# Altium schematic sheet Power_HK.SchDoc: Hrafn
size Tabloid; DrawnBy: Nicholas Belsten; Organization: MIT; Address1: Route 40; Address2: Westford MA 01886; Address3: USA; DocumentNumber: 5; SheetNumber: 6; SheetTotal: 10; DCN: Aika; ProgramName: AERO-VISTA; Section: Power + Housekeeping
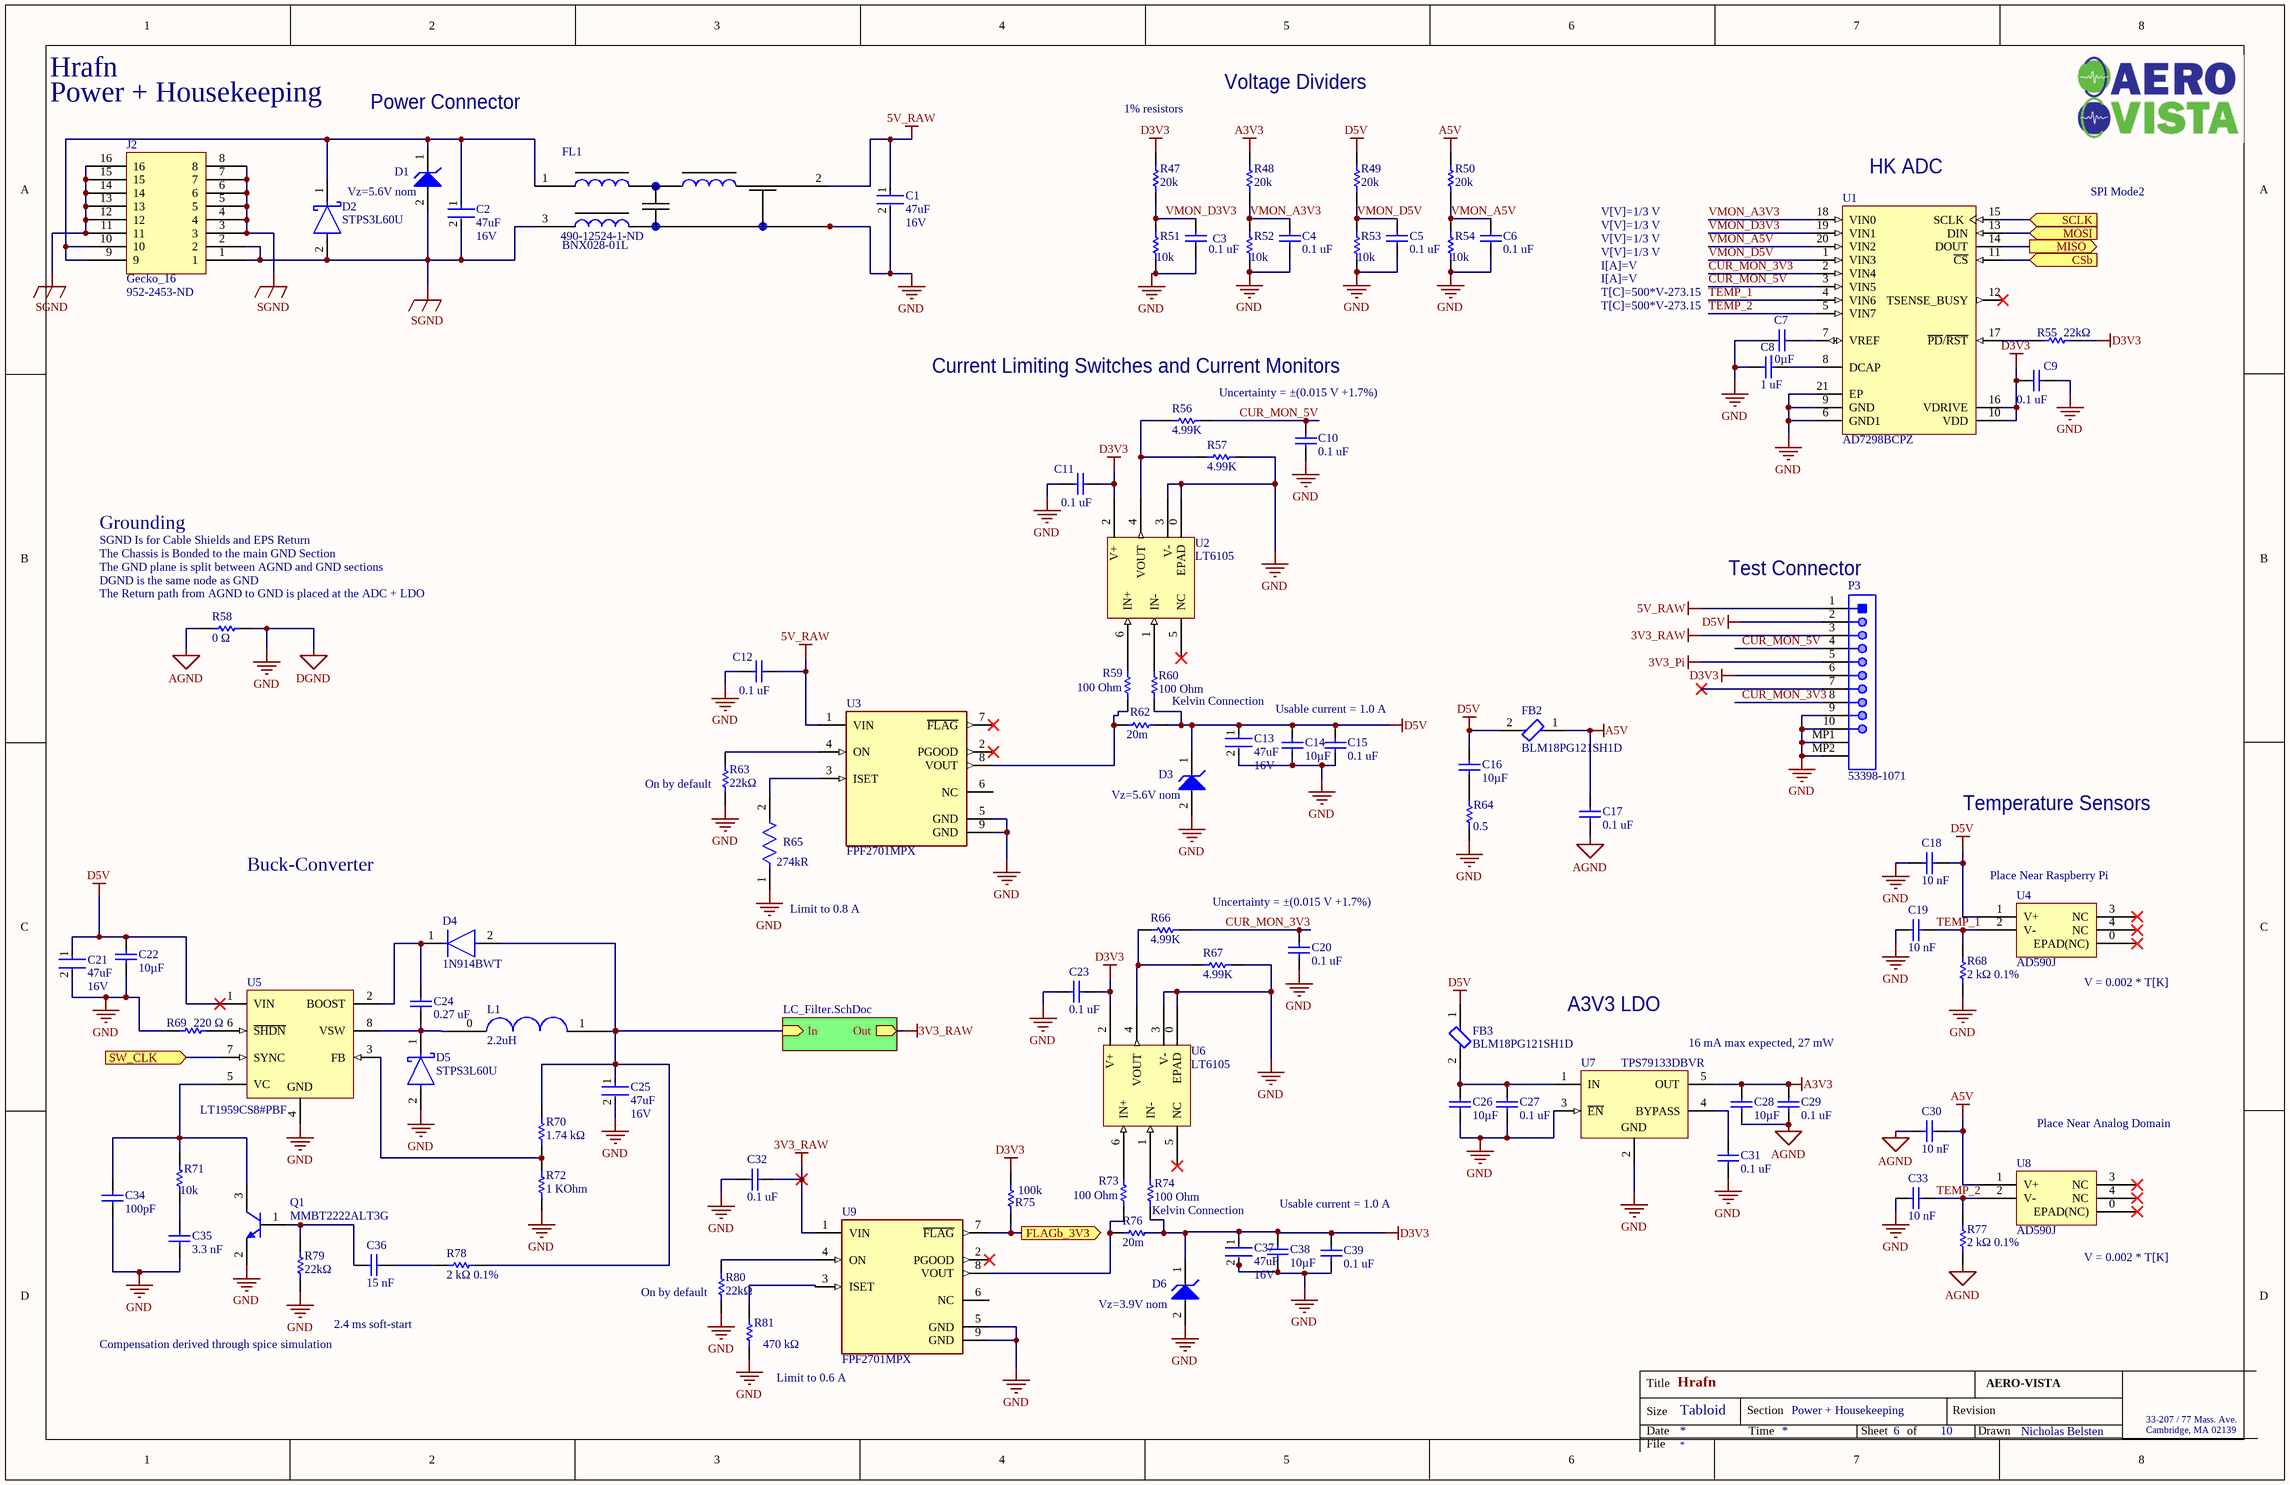
[diagram p0: Power_HK.SchDoc]

## Parts
C1  Capacitance: 47uF  Voltage Rating: 16V  [FP-GRT32E-0_3-IPC_C]  (hidden comment: GRT32EC81C476ME13L)
C2  Capacitance: 47uF  Voltage Rating: 16V  [FP-GRT32E-0_3-IPC_C]  (hidden comment: GRT32EC81C476ME13L)
C3  0.1 uF  [CAPC0402(1005)60_L]
C4  0.1 uF  [CAPC0402(1005)60_L]
C5  0.1 uF  [CAPC0402(1005)60_L]
C6  0.1 uF  [CAPC0402(1005)60_L]
C7  Capacitance: 10µF  [CAPC1608X100X35LL20T25]  (hidden comment: EMK107BBJ106MA-T)
C8  1 uF  [CAPC1005X60X30NL05T10]
C9  0.1 uF  [CAPC0402(1005)60_L]
C10  0.1 uF  [CAPC0402(1005)60_L]
C11  0.1 uF  [CAPC0402(1005)60_L]
C12  0.1 uF  [CAPC0402(1005)60_L]
C13  Capacitance: 47uF  Voltage Rating: 16V  [FP-GRT32E-0_3-IPC_C]  (hidden comment: GRT32EC81C476ME13L)
C14  Capacitance: 10µF  [CAPC1608X100X35LL20T25]  (hidden comment: EMK107BBJ106MA-T)
C15  0.1 uF  [CAPC0402(1005)60_L]
C16  Capacitance: 10µF  [CAPC1608X100X35LL20T25]  (hidden comment: EMK107BBJ106MA-T)
C17  0.1 uF  [CAPC0402(1005)60_L]
C18  10 nF  [CAPC1005X56X25NL10T15]
C19  10 nF  [CAPC1005X56X25NL10T15]
C20  0.1 uF  [CAPC0402(1005)60_L]
C21  Capacitance: 47uF  Voltage Rating: 16V  [FP-GRT32E-0_3-IPC_C]  (hidden comment: GRT32EC81C476ME13L)
C22  Capacitance: 10µF  [CAPC1608X100X35LL20T25]  (hidden comment: EMK107BBJ106MA-T)
C23  0.1 uF  [CAPC0402(1005)60_L]
C24  0.27 uF  [CAPC1005X55X25LL05T10]
C25  Capacitance: 47uF  Voltage Rating: 16V  [FP-GRT32E-0_3-IPC_C]  (hidden comment: GRT32EC81C476ME13L)
C26  Capacitance: 10µF  [CAPC1608X100X35LL20T25]  (hidden comment: EMK107BBJ106MA-T)
C27  0.1 uF  [CAPC0402(1005)60_L]
C28  Capacitance: 10µF  [CAPC1608X100X35LL20T25]  (hidden comment: EMK107BBJ106MA-T)
C29  0.1 uF  [CAPC0402(1005)60_L]
C30  10 nF  [CAPC1005X56X25NL10T15]
C31  0.1 uF  [CAPC0402(1005)60_L]
C32  0.1 uF  [CAPC0402(1005)60_L]
C33  10 nF  [CAPC1005X56X25NL10T15]
C34  100pF  [CAPC1005X55X25ML05T10]
C35  3.3 nF  [CAPC1005X56X25ML10T15]
C36  15 nF  [CAPC1005X55X25NL05T10]
C37  Capacitance: 47uF  Voltage Rating: 16V  [FP-GRT32E-0_3-IPC_C]  (hidden comment: GRT32EC81C476ME13L)
C38  Capacitance: 10µF  [CAPC1608X100X35LL20T25]  (hidden comment: EMK107BBJ106MA-T)
C39  0.1 uF  [CAPC0402(1005)60_L]
D1  Vz=5.6V nom  [ONSC-SMA-2-403D-02_F_V]
D2  STPS3L60U  [FP-SMB-MFG]
D3  Vz=5.6V nom  [ONSC-SMA-2-403D-02_F_V]
D4  1N914BWT  [FP-502-01-MFG]
D5  STPS3L60U  [FP-SMB-MFG]
D6  Vz=3.9V nom  [ONSC-SMA-2-403D-02_F_V]
FB2  BLM18PG121SH1D  [FP-BLM18-0_15-t0_8-IPC_C]
FB3  BLM18PG121SH1D  [FP-BLM18-0_15-t0_8-IPC_C]
FL1  BNX028-01L  Supplier Part Number 1: 490-12524-1-ND  [FIL_BNX028-01L - small]
J2  Gecko_16  Supplier Part Number 1: 952-2453-ND  [GECK16]
L1  Inductance: 2.2uH  [78438357022]  (hidden comment: L)
P3  53398-1071  [MOLX-53398-1071_V]
Q1  MMBT2222ALT3G  [ONSC-SOT-23-3-318-08_V]
R47  Resistance: 20k  [RESC1005X40X25LL05T10]  (hidden comment: RC0402FR-0720KL)
R48  Resistance: 20k  [RESC1005X40X25LL05T10]  (hidden comment: RC0402FR-0720KL)
R49  Resistance: 20k  [RESC1005X40X25LL05T10]  (hidden comment: RC0402FR-0720KL)
R50  Resistance: 20k  [RESC1005X40X25LL05T10]  (hidden comment: RC0402FR-0720KL)
R51  Resistance: 10k  [RESC1005X40X25LL05T10]  (hidden comment: CRCW040210K0FKEDHP)
R52  Resistance: 10k  [RESC1005X40X25LL05T10]  (hidden comment: CRCW040210K0FKEDHP)
R53  Resistance: 10k  [RESC1005X40X25LL05T10]  (hidden comment: CRCW040210K0FKEDHP)
R54  Resistance: 10k  [RESC1005X40X25LL05T10]  (hidden comment: CRCW040210K0FKEDHP)
R55  22kΩ  [RESC1005X40X25LL05T05]
R56  4.99K  [RESC1005X40X25LL05T05]
R57  4.99K  [RESC1005X40X25LL05T05]
R58  =Resistance: 0 Ω  [RESC1608X55X25LL10T15]  (hidden comment: AC0603JR-070RL)
R59  Resistance: 100 Ohm  [RESC1005X40X25LL05T05]  (hidden comment: ERJ-2RKF1000X)
R60  Resistance: 100 Ohm  [RESC1005X40X25LL05T05]  (hidden comment: ERJ-2RKF1000X)
R62  20m  [RESC1608X55X25LL10T15]
R63  22kΩ  [RESC1005X40X25LL05T05]
R64  0.5  [RESC1005X40X25LL10T10]
R65  Resistance: 274kR  [FP-CRCW0402-e3-IPC_A]  (hidden comment: CRCW0402274KFKED)
R66  4.99K  [RESC1005X40X25LL05T05]
R67  4.99K  [RESC1005X40X25LL05T05]
R68  2 kΩ 0.1%  [RESC1005X40X25LL10T10]
R69  220 Ω  [RESC1005X40X25LL05T05]
R70  1.74 kΩ  [RESC1005X40X25NL05T10]
R71  Resistance: 10k  [RESC1005X40X25LL05T10]  (hidden comment: CRCW040210K0FKEDHP)
R72  1 KOhm  [RESC1005X40X25NL05T05]
R73  Resistance: 100 Ohm  [RESC1005X40X25LL05T05]  (hidden comment: ERJ-2RKF1000X)
R74  Resistance: 100 Ohm  [RESC1005X40X25LL05T05]  (hidden comment: ERJ-2RKF1000X)
R75  Resistance: 100k  [RESC1005X40X25LL05T05]  (hidden comment: CRCW0402100KJNED)
R76  20m  [RESC1608X55X25LL10T15]
R77  2 kΩ 0.1%  [RESC1005X40X25LL10T10]
R78  2 kΩ 0.1%  [RESC1005X40X25LL10T10]
R79  22kΩ  [RESC1005X40X25LL05T05]
R80  22kΩ  [RESC1005X40X25LL05T05]
R81  Resistance: 470 kΩ  [RESC1005X40X25LL05T05]  (hidden comment: ERJ2RKF4703X)
U1  AD7298BCPZ  [CP-20-8_M]
U2  LT6105  [LT6105]
U3  FPF2701MPX  [FP-511DD-MFG]
U4  AD590J  [DFN260P300X75-4N]
U5  LT1959CS8#PBF  [LT-S8-8_L]
U6  LT6105  [LT6105]
U7  TPS79133DBVR  [DBV0005A_N]
U8  AD590J  [DFN260P300X75-4N]
U9  FPF2701MPX  [FP-511DD-MFG]

## Sub-sheets
LCF = LC_Filter.SchDoc: In (in), Out (out)

## Ports
CSb (in), FLAGb_3V3 (out), MISO (out), MOSI (in), SCLK (in), SW_CLK (in)

## Nets
3V3_Pi: P3.5
3V3_RAW: C32.1 P3.3 U9.1(VIN) ; sheet LCF/Out
5V_RAW: C1.1 C12.2 FL1.2(CB) P3.1 U3.1(VIN)
A3V3: C28.2 C29.2 R48.2 U7.5(OUT)
A5V: C17.2 C30.2 FB2.1 R50.2 U8.1(V+)
AGND: C17.1 C28.1 C29.1 C30.1 R58.1 R77.1
D3V3: C9.1 C11.2 C23.1 C37.1 C38.2 C39.2 D6.1(K) P3.6 R47.2 R55.2 R74.1 R75.2 R76.2 U1.10(VDD) U1.16(VDRIVE) U2.2(V+) U6.2(V+)
D5V: C13.1 C14.2 C15.2 C16.2 C18.2 C21.1 C22.2 D3.1(K) FB2.2 FB3.1 P3.2 R49.2 R60.1 R62.2 U4.1(V+) U5.1(VIN)
DGND: C1.2 C3.1 C4.1 C5.1 C6.1 C7.1 C8.2 C9.2 C10.1 C11.1 C12.1 C13.2 C14.1 C15.1 C18.1 C19.1 C20.1 C21.2 C22.1 C23.2 C25.2 C26.1 C27.1 C31.1 C32.2 C33.1 C34.1 C35.1 C37.2 C38.1 C39.1 D3.2(A) D5.2(A) D6.2(A) FL1.4(CG) FL1.5(CG) FL1.6(CG) P3.9 P3.10 P3.MP1 P3.MP2 Q1.2(E) R51.1 R52.1 R53.1 R54.1 R57.2 R58.2 R63.1 R64.1 R65.1 R67.2 R68.1 R69.1 R72.1 R79.1 R80.1 R81.1 U1.6(GND1) U1.9(GND) U1.21(EP) U2.0(EPAD) U2.3(V-) U3.5(GND) U3.9(GND) U5.4(GND) U6.0(EPAD) U6.3(V-) U7.2(GND) U7.3(~{EN}) U9.5(GND) U9.9(GND)  [also labelled GND]
SGND: C2.2 D1.2(A) D2.2(A) FL1.3(PSG) J2.1 J2.2 J2.3 J2.4 J2.5 J2.6 J2.7 J2.8 J2.11 J2.12 J2.13 J2.14 J2.15 J2.16
CSb: U1.11(~{CS}) ; port CSb
CUR_MON_3V3: C20.2 P3.8 R66.2 U1.2(VIN4)
CUR_MON_5V: C10.2 P3.4 R56.2 U1.3(VIN5)
FLAGb_3V3: R75.1 U9.7(~{FLAG}) ; port FLAGb_3V3
MISO: U1.14(DOUT) ; port MISO
MOSI: U1.13(DIN) ; port MOSI
SCLK: U1.15(SCLK) ; port SCLK
SW_CLK: U5.7(SYNC) ; port SW_CLK
TEMP_1: C19.2 R68.2 U1.4(VIN6) U4.2(V-)
TEMP_2: C33.2 R77.2 U1.5(VIN7) U8.2(V-)
VMON_A3V3: C4.2 R48.1 R52.2 U1.18(VIN0)
VMON_A5V: C6.2 R50.1 R54.2 U1.20(VIN2)
VMON_D3V3: C3.2 R47.1 R51.2 U1.19(VIN1)
VMON_D5V: C5.2 R49.1 R53.2 U1.1(VIN3)
NetC2_1: C2.1 D1.1(K) D2.1(K) FL1.1(B) J2.9 J2.10
NetC7_2: C7.2 U1.7(VREF)
NetC8_1: C8.1 U1.8(DCAP)
NetC16_1: C16.1 R64.2
NetC24_1: C24.1 D5.1(K) L1.0 U5.8(VSW)
NetC24_2: C24.2 D4.1(C) U5.2(BOOST)
NetC25_1: C25.1 D4.2(A) L1.1 R70.2 R78.1 ; sheet LCF/In
NetC26_2: C26.2 C27.2 FB3.2 U7.1(IN)
NetC31_2: C31.2 U7.4(BYPASS)
NetC34_2: C34.2 Q1.3(C) R71.2 U5.5(VC)
NetC35_2: C35.2 R71.1
NetC36_1: C36.1 Q1.1(B) R79.2
NetC36_2: C36.2 R78.2
NetR55_1: R55.1 U1.17(~{PD}/~{RST})
NetR56_1: R56.1 R57.1 U2.4(VOUT)
NetR59_1: R59.1 R62.1 U3.8(VOUT)
NetR59_2: R59.2 U2.6(IN+)
NetR60_2: R60.2 U2.1(IN-)
NetR63_2: R63.2 U3.4(ON)
NetR65_2: R65.2 U3.3(ISET)
NetR66_1: R66.1 R67.1 U6.4(VOUT)
NetR69_2: R69.2 U5.6(~{SHDN})
NetR70_1: R70.1 R72.2 U5.3(FB)
NetR73_1: R73.1 R76.1 U9.8(VOUT)
NetR73_2: R73.2 U6.6(IN+)
NetR74_2: R74.2 U6.1(IN-)
NetR80_2: R80.2 U9.4(ON)
NetR81_2: R81.2 U9.3(ISET)

Not connected (* = marked no-connect by the designer): P3 7*; U1 12(TSENSE_BUSY)*; U2 5(NC)*; U3 2(PGOOD)* 6(NC) 7(~{FLAG})*; U4 0(EPAD(NC))* 3(NC)* 4(NC)*; U6 5(NC)*; U8 0(EPAD(NC))* 3(NC)* 4(NC)*; U9 2(PGOOD)* 6(NC)

## Notes on the sheet
- Voltage Dividers
- Power Connector
- 1% resistors
- V[V]=1/3 V
- (near U1) HK ADC
- SPI Mode2
- I[A]=V
- T[C]=500*V-273.15
- Current Limiting Switches and Current Monitors
- Uncertainty = ±(0.015 V +1.7%)
- Grounding
- SGND Is for Cable Shields and EPS Return
- The Chassis is Bonded to the main GND Section
- The GND plane is split between AGND and GND sections
- (near R58) The Return path from AGND to GND is placed at the ADC + LDO
- (near R58) DGND is the same node as GND
- (near P3) Test Connector
- Kelvin Connection
- Usable current = 1.0 A
- (near R63) On by default
- Temperature Sensors
- Buck-Converter
- Place Near Raspberry Pi
- Limit to 0.8 A
- A3V3 LDO
- (near U4) V = 0.002 * T[K]
- 16 mA max expected, 27 mW
- Place Near Analog Domain
- (near R74) Kelvin Connection
- (near R80) On by default
- (near U8) V = 0.002 * T[K]
- Compensation derived through spice simulation
- 2.4 ms soft-start
- Limit to 0.6 A
- Title
- Size
- Date
- Tabloid
- Section
- Time
- Sheet
- of
- Revision
- Drawn
- 33-207 / 77 Mass. Ave.
- Cambridge, MA 02139
- File

## Library data of the parts
C1 C2 C13 C21 C25 C37 = CMP-06035-034903-1: Multi-Layer Ceramic Capacitor 47uF 16V X6S ±20% 1210 Emboss T/R; Ratings: AEC-Q200; Thickness: 0.106inch; Max Operating Temperature: 105°C; Width: 0.098inch; Case/Package: 1210; Length: 0.126inch; Mount: Surface Mount; Min Operating Temperature: -55°C; Tolerance: 20%; Case Code (Imperial): 1210; Case Code (Metric): 3225; Packaging: Tape and Reel
C3-C6 C9-C12 C15 C17 C20 C23 C27 C29 C31 C32 C39 = CMP-1034-02068-1: CAP 100nF 16V ±5% 0402 (1005 Metric) Thickness 0.6mm SMD; Tolerance: Â±5%; Case-EIA: 0402; Case-Metric: 1005; Technology: SMT; Value: 100nF; Max Thickness: 0.6 mm; Rated Voltage: 16 V
C7 C14 C16 C22 C26 C28 C38 = CMP-2000-06226-1: Chip Capacitor, 10 uF, +/- 20%, 16 V, -55 to 85 degC, 0603 (1608 Metric), RoHS, Tape and Reel; Manufacturer: Taiyo Yuden; Voltage - Rated: 16V; Temperature Coefficient: X5R; Other Names: 587-3238-6; Online Catalog: MSeries; Features: -; Thickness (Max): 0.031"(0.80mm); Package / Case: 0603(1608Metric); Datasheet URL: http://www.yuden.co.jp/ut/product/category/capacitor/EMK107BBJ106MA-T.pdf; Category: Capacitors; Lead Style: -; Family: CeramicCapacitors; Package Description: 2-Pin Surface Mount Device, Body 1.70 x 0.90 mm; Tolerance: ±20%; Manufacturer URL: http://www.t-yuden.com/; Operating Temperature: -55°C~85°C; Lead Spacing: -; Height - Seated (Max): -; Series: M; Applications: GeneralPurpose; Size / Dimension: 0.063"Lx0.031"W(1.60mmx0.80mm); Standard Package: 1; Packaging: Digi-Reel®; Mounting Technology: SurfaceMount; Package Reference: 0603; Ratings: -; Datasheet Version: 10/2016; Mounting Type: SurfaceMount,MLCC
C8 = CMP-2008-02056-1: Part Number: C0402C105M8PACTU; Manufacturer: Kemet; Capacitance: 1 uF
C18 C19 C30 C33 = CMP-2008-02912-1: Part Number: 0402ZC103KAT2A; Manufacturer: AVX Interconnect / Elco; Capacitance: 10 nF
C24 = CMP-2008-03996-1: Part Number: GRM155R61A274KE15D; Manufacturer: Murata; Capacitance: 0.27 uF
C34 = CMP-2008-03915-1: Manufacturer: Murata; Part Number: GRM1555C1H101JA01D; Capacitance: 100pF
C35 = CMP-2008-02911-1: Manufacturer: AVX Interconnect / Elco; Part Number: 04025C332JAT2A; Capacitance: 3.3 nF
C36 = CMP-2008-04644-1: Part Number: GRM155R71H153KA12J; Manufacturer: Murata; Capacitance: 15 nF
D1 D3 = CMP-1060-00073-1: 1.5 W Zener Voltage Regulator, 2-Pin SMA, Pb-Free, Tape and Reel; PartNumber: SZ1SMA5919BT3G; Manufacturer: On Semiconductor; VZ Typ (V): 5.6; RoHS: Pb-Free; PackageVersion: Rev. F, 11/2008; ComponentLink1Description: Manufacturer URL; Mounting Technology: Surface Mount; PackageDescription: 2-Pin Small Molded Package, J-Bend Lead, Body 2.605 x 4.315 mm; DatasheetVersion: Rev. 8; ComponentLink3URL: http://www.onsemi.com/pub_link/Collateral/1SMA5913BT3-D.PDF; ComponentLink3Description: Package Specification; ComponentLink2URL: http://www.onsemi.com/pub_link/Collateral/1SMA5913BT3-D.PDF; Packing: Tape and Reel; ComponentLink1URL: http://www.onsemi.com/; ComponentLink2Description: Datasheet; PackageReference: SMA-2-403D-02_F
D2 D5 = CMP-12187-000023-1: DIODE SCHOTTKY 60V 3A SMB; Manufacturer: STMicroelectronics; Standoff Height: 0.05mm; Peak Reverse Current: 150uA; Max Junction Temp: +150°C; Max Surge Forward Current: 100A; Octopart: https://octopart.com/stps3l60u-stmicroelectronics-334329; Category: Diode; Height: 2.65mm; RoHS: TRUE; Mouser Description: Schottky diode Configuration: Single Housing type: DO-214AA=SMB Peak conducting-state current: 100 A; Forward Current: 3A; Manufacturer Part Number: STPS3L60U; Temperature: to +150°C; ComponentLink2URL: https://www.st.com/resource/en/datasheet/stps3l60.pdf; Max Repetitive Reverse Voltage: 60V; Device Class L1: Discrete Semiconductors; Automotive: No; Device Class L3: Schottky Diodes; Digikey Description: DIODE SCHOTTKY 60V 3A SMB; Lead Free: Yes; Temperature Range High: +150°C; Package: SMB; ComponentLink2Description: Datasheet; Device Class L2: Diodes
D4 = CMP-07163-000008-1: DIODE GEN PURP 75V 200MA SOD523F; Manufacturer: ON Semiconductor; Forward Current: 300mA; Capacitance: 4pF; Max Junction Temp: +150°C; Reverse Voltage: 100V; Value: 4pF; Peak Reverse Current: 5uA; ComponentLink2Description: Datasheet; Package: 502-01; Manufacturer Part Number: 1N914BWT; Digikey Description: DIODE GEN PURP 75V 200MA SOD523F; Temperature Range High: +150°C; Temperature: -55°C to +150°C; Footprint Url: https://www.onsemi.com/pub/Collateral/502-01.PDF; Device Class L2: Diodes; Lead Free: Yes; Automotive: No; Category: Diode; Octopart: https://octopart.com/1n914bwt-on+semiconductor-84323166; Device Class L1: Discrete Semiconductors; Ipc Land Pattern Name: SODFL16080X60; Device Class L3: Rectifier Diodes; Height: 0.7mm; Max Repetitive Reverse Voltage: 75V; Mouser Description: Diodes - General Purpose, Power, Switching SINGLE JUNC. 100V 4.0NS COMP; Temperature Range Low: -55°C; ComponentLink2URL: https://www.onsemi.com/pub/Collateral/1N914BWT-D.pdf; RoHS: TRUE
D6 = CMP-1060-00126-1: 1.5 W Zener Voltage Regulator, 2-Pin SMA, Pb-Free, Tape and Reel; Manufacturer: On Semiconductor; PartNumber: 1SMA5915BT3G; VZ Typ (V): 3.9; DatasheetVersion: Rev. 8; Packing: Tape and Reel; PackageDescription: 2-Pin Small Molded Package, J-Bend Lead, Body 2.605 x 4.315 mm; PackageVersion: Rev. F, 11/2008; Mounting Technology: Surface Mount; ComponentLink2Description: Datasheet; ComponentLink3URL: http://www.onsemi.com/pub_link/Collateral/1SMA5913BT3-D.PDF; PackageReference: SMA-2-403D-02_F; ComponentLink2URL: http://www.onsemi.com/pub_link/Collateral/1SMA5913BT3-D.PDF; RoHS: Pb-Free; ComponentLink1URL: http://www.onsemi.com/; ComponentLink1Description: Manufacturer URL; ComponentLink3Description: Package Specification
FB2 FB3 = CMP-06046-000335-1: Chip Ferrite Bead, 0603, 120Ω @ 100MHz, 0.05Ω, 25%, 2A; Impedance: 120R; Shielding: Unshielded; Number of Lines: 1; DC Resistance (DCR): 50mR; Case/Package: 0603; Max Current Rating: 2A; Ratings: AEC-Q200; Case Code (Metric): 1608; Height: 0.8mm; Max DC Current: 2A; Contact Plating: Tin; Max Operating Temperature: 125°C; Width: 0.031inch; Number of Circuits: 1; Min Operating Temperature: -55°C; Mount: Surface Mount; Test Frequency: 100MHz; Tolerance: 25%; Packaging: Tape and Reel; Length: 1.6mm; Weight: 7.1E-05oz; Package Quantity: 4000; Case Code (Imperial): 0603; Termination: SMD/SMT; Material: Ferrite; Depth: 0.8mm; Lead Free: Lead Free; Current Rating: 2A
FL1 = BNX028-01L: FILTER LC 47UF SMD; MF: Murata; Number of Channels: 2; Attenuation Value: 35dB; Current: 15A; ESD Protection: No; Voltage Rating: 16V; Frequency: 1GHz; SnapEDA_Link: https://www.snapeda.com/parts/BNX028-01L/Murata/view-part/4300575/?ref=snap; MP: BNX028-01L; DigiKey-Purchase-URL: https://snapeda.com/shop?store=DigiKey&id=4300575; Digi-Key_Part_Number: 490-12524-1-ND; Package: SMD-4 Murata; Value: *; Supplier 1: Digi-Key; Manufacturer: Murata; Manufacturer Part Number: BNX028-01L; RoHS: Yes; Category: EMI / RFI Components; Stock 1: 641; Pricing 1: 1=7.19000, 10=6.12300, 25=4.75160, 50=4.52540, 100=4.25920 (USD); Mount: Surface Mount; Case/Package: SMD/SMT; Min Operating Temperature: -40°C; Max Operating Temperature: 105°C; Package Quantity: 400; Packaging: Tape and Reel; Max Current Rating: 15A; Termination: SMD/SMT; Voltage Rating (DC): 16V; Current Rating: 15A; Circuit Type: Filter; Insertion Loss: 35dB; Capacitance: 47uF; Length: 12.1mm; Height: 3.5mm; Width: 9.1mm; Depth: 9.1mm; REACH SVHC: No SVHC; ComponentLink1URL: http://www.mouser.com/ds/2/281/ENFH0008-558688.pdf?src-supplier=Mouser; ComponentLink1Description: http://www.mouser.com/ds/2/281/ENFH0008-558688.pdf?src-supplier=Mouser; ComponentLink2URL: http://www.farnell.com/datasheets/1902097.pdf?src-supplier=Farnell; ComponentLink2Description: http://www.farnell.com/datasheets/1902097.pdf?src-supplier=Farnell; ComponentLink3URL: http://www.farnell.com/datasheets/1902097.pdf?src-supplier=Element14; ComponentLink3Description: http://www.farnell.com/datasheets/1902097.pdf?src-supplier=Element14; ComponentLink4URL: http://www.murata.com/en-us/products/productdata/8796777775134/ENFH0008.pdf?src-supplier=Digi-Key; ComponentLink4Description: http://www.murata.com/en-us/products/productdata/8796777775134/ENFH0008.pdf?src-supplier=Digi-Key; ComponentLink5URL: https://www.murata.com/en-us/products/productdata/8796777775134/ENFH0008.pdf?src-supplier=Digi-Key; ComponentLink5Description: https://www.murata.com/en-us/products/productdata/8796777775134/ENFH0008.pdf?src-supplier=Digi-Key; ComponentLink6URL: http://www.farnell.com/datasheets/1902097.pdf?src-supplier=Newark; ComponentLink6Description: http://www.farnell.com/datasheets/1902097.pdf?src-supplier=Newark
J2 = Gecko_16: Headers & Wire Housings 1.25MM M VERT 3.0MM 2X8 POS; Manufacturer 1: Harwin; Manufacturer Part Number 1: G125-MV11605L1P; Gender: Male; Number of Contacts: 16; Connector Type: Male Pin; Current Rating: 2A; Voltage Rating: 450V; Insulation: Insulated; Insulation Resistance: 1GR; Pitch: 0.049inch; Supplier 1: Digi-Key; RoHS: Yes; Category: Headers and Wire Housings; Stock 1: 282; Pricing 1: 1=5.45000, 10=5.23000, 100=4.35800, 500=3.70430, 1000=3.15955, 5000=2.83270 (USD); Mount: Through Hole; Housing Material: Thermoplastic; Contact Plating: Gold; Contact Material: Bronze; Color: Green; Min Operating Temperature: -65°C; Max Operating Temperature: 150°C; Packaging: Cut Strip; Number of Rows: 2; Fastening Type: Latch; Contact Gender: Male; Package Quantity: 1; Number of Positions: 16; Termination: Through Hole; Length: 8.75mm; Row Spacing: 0.049inch; REACH SVHC: No SVHC; ComponentLink1URL: http://www.farnell.com/datasheets/2368209.pdf?src-supplier=Farnell; ComponentLink1Description: http://www.farnell.com/datasheets/2368209.pdf?src-supplier=Farnell; ComponentLink2URL: http://www.mouser.com/ds/2/181/G125-MV-215032.pdf?src-supplier=Mouser; ComponentLink2Description: http://www.mouser.com/ds/2/181/G125-MV-215032.pdf?src-supplier=Mouser; ComponentLink3URL: http://www.farnell.com/datasheets/2047904.pdf?src-supplier=Element14; ComponentLink3Description: http://www.farnell.com/datasheets/2047904.pdf?src-supplier=Element14; ComponentLink4URL: https://cdn.harwin.com/pdfs/Harwin_PC_Gecko.pdf?src-supplier=Digi-Key; ComponentLink4Description: https://cdn.harwin.com/pdfs/Harwin_PC_Gecko.pdf?src-supplier=Digi-Key
L1 = L: Power Inductor, Aec-Q200, 2.2Uh, 5.2A Rohs Compliant: Yes; Manufacturer 1: Wurth Electronics; Core Material: Ferrite; Tolerance: 20%; Saturation Current: 7A; Shielding: Shielded; DC Resistance (DCR): 26mR; Self Resonant Frequency: 35MHz; Test Frequency: 100kHz; Supplier 1: Digi-Key; Supplier Part Number 1: 732-11741-1-ND; Manufacturer Part Number 1: 78438357022; RoHS: No; Category: Fixed Inductors; Stock 1: 4591; Pricing 1: 1=1.81000, 10=1.77600, 50=1.69700, 100=1.56300 (USD); Mount: Surface Mount; Case/Package: Nonstandard; Min Operating Temperature: -40°C; Max Operating Temperature: 125°C; Resistor Type: Wirewound; Packaging: Cut Tape; Current Rating: 5.2A; Ratings: AEC-Q200; RoHS Compliant: No; ComponentLink1URL: https://katalog.we-online.de/pbs/datasheet/78438357022.pdf?src-supplier=Digi-Key; ComponentLink1Description: https://katalog.we-online.de/pbs/datasheet/78438357022.pdf?src-supplier=Digi-Key
P3 = CMP-2000-05635-1: Male Header, Pitch 1.25 mm, 1 x 10 Position, Height 4.7 mm, -40 to 85 degC, RoHS, Tape and Reel; Manufacturer: Molex; Mounting Angle: Vertical; Pitch: 1.25mm; Voltage Rating: 125V; Current Rating: 1A; Number of Rows: 1Row; Housing Material: Nylon; Mounting Technology: SurfaceMount; Mounting Style: SMD; Contact Material: PhosphorBronze; Product: Headers; Datasheet URL: http://www.molex.com/pdm_docs/sd/533981071_sd.pdf; Manufacturer URL: http://www.molex.com/; Datasheet Version: Rev. J, 09/2015; Factory Pack Quantity: 1000; Brand: Molex; Packaging: Reel; Product Category: Headers&WireHousings; Contact Gender: Pin(Male); Number of Positions: 10Position; RoHS: Details; Contact Plating: Tin; Package Description: Male Header, Pitch 1.25 mm, 1 x 10 Position, Height 4.7 mm; Series: 53398; Type: Shrouded; Package Reference: 53398-1071; Tradename: PicoBlade; Termination Style: SMD
Q1 = CMP-1048-00592-1: General Purpose Transistor, NPN Silicon, 3-Pin SOT-23, Pb-Free, Tape and Reel; Manufacturer: On Semiconductor; fT Min (MHz): 300; IC Continuous (A): 0.6; PackageReference: SOT-23-3-318-08; ComponentLink3URL: http://www.onsemi.cn/pub_link/Collateral/318-08.PDF; DatasheetVersion: Rev. 10; Packing: Tape and Reel; Mounting Technology: Surface Mount; ComponentLink2Description: Datasheet; ComponentLink1URL: http://www.onsemi.com/; ComponentLink2URL: http://www.onsemi.cn/pub_link/Collateral/MMBT2222LT1-D.PDF; PackageVersion: Rev. AP, 11/2009; PartNumber: MMBT2222ALT3G; RoHS: TRUE; PackageDescription: 3-Pin Small Outline Transistor, Body 2.92 x 1.3 mm, Pitch 0.95 mm; ComponentLink3Description: Package Specification; Polarity: NPN; ComponentLink1Description: Manufacturer URL
R47-R50 = CMP-2002-07501-1: Manufacturer: Yageo / Phycomp; Part Number: RC0402FR-0720KL
R51-R54 R71 = CMP-2002-03043-1: Manufacturer: Vishay Dale; Part Number: CRCW040210K0FKEDHP
R55 R63 R79 R80 = CMP-2002-00489-1: Manufacturer: Panasonic; Part Number: ERJ-2GEJ223X; Resistance: 22kΩ
R56 R57 R66 R67 = CMP-2002-00966-3: Chip Resistor, 4.99 KOhm, +/- 1%, 100 mW, -55 to 155 degC, 0402 (1005 Metric), RoHS, Tape and Reel; Manufacturer: Basic Passives; PartNumber: ERJ-2RKF4991X; Power Rating: 100 mW; Case\/Package: 0402; Voltage Rating: 50 V; REACH SVHC: Unknown; PackageDescription: 2-Pin Surface Mount Device, Body 1 x 0.5 mm; Mounting Technology: Surface Mount; ComponentLink2URL: http://industrial.panasonic.com/cdbs/www-data/pdf/RDA0000/AOA0000C86.pdf; Packaging: Tape and Reel; Case Code (Imperial): 0402; PackageReference: 0402; Min Operating Temperature: -55 degC; ComponentLink1URL: http://www.panasonic.com/; Width: 0.5 mm; Mount: Surface Mount; Max Operating Temperature: 155 degC; Radiation Hardening: No; Resistance: 4.99 KOhm; ComponentLink1Description: Manufacturer URL; Case Code (Metric): 1005; Pins: 2; Package Quantity: 10000; DatasheetVersion: 04/2015; ComponentLink2Description: Datasheet; Weight: 2.8E-05oz; Length: 1 mm; Tolerance: 1%; RoHSCompliant: true; Height: 0.35 mm
R58 = CMP-2000-04856-1: Manufacturer: Yageo; Part Number: AC0603JR-070RL
R59 R60 R73 R74 = CMP-2002-00605-3: Chip Resistor, 100 Ohm, +/- 1%, 100 mW, -55 to 155 degC, 0402 (1005 Metric), RoHS, Tape and Reel; Manufacturer: Basic Passives; Power Rating: 100 mW; Voltage Rating: 50 V; Case\/Package: 0402; Width: 0.5 mm; Pins: 2; ComponentLink2Description: Datasheet; PackageReference: 0402; Height: 0.35 mm; Tolerance: 1%; DatasheetVersion: 04/2015; Case Code (Imperial): 0402; Min Operating Temperature: -55 degC; Radiation Hardening: No; Length: 1 mm; Package Quantity: 10000; PackageDescription: 2-Pin Surface Mount Device, Body 1 x 0.5 mm; Mounting Technology: Surface Mount; Case Code (Metric): 1005; Packaging: Tape and Reel; ComponentLink1URL: http://www.panasonic.com/; RoHSCompliant: true; Max Operating Temperature: 155 degC; REACH SVHC: Yes; PartNumber: ERJ-2RKF1000X; ComponentLink1Description: Manufacturer URL; ComponentLink2URL: http://industrial.panasonic.com/cdbs/www-data/pdf/RDA0000/AOA0000C86.pdf; Mount: Surface Mount
R62 R76 = CMP-2000-04331-1: Manufacturer: Yageo; Part Number: RL0603FR-070R02L
R64 = CMP-2002-06398-1: Part Number: RL0402FR-070R5L; Manufacturer: Yageo
R65 = CMP-2002-08429-2: RES Thick Film, 274kΩ, 1%, 0.063W, 100ppm/°C, 0402; Power Rating: 63mW; Voltage Rating: 50V; Case/Package: 0402; Tolerance: 1%; Mount: Surface Mount; Case Code (Metric): 1005; Width: 0.5mm; Length: 1mm; Min Operating Temperature: -55°C; Number of Pins: 2; Composition: Thick Film; Height: 0.35mm; Radiation Hardening: No; Max Operating Temperature: 155°C; Packaging: Tape and Reel; Package Quantity: 10000; Depth: 0.5mm; Lead Free: Lead Free; Voltage Rating (DC): 50V; Termination: SMD/SMT; Temperature Coefficient: 100ppm/°C; Contact Plating: Tin; Weight: 2.3E-05oz; Case Code (Imperial): 0402; Military Standard: Not
R68 R77 R78 = CMP-2002-05790-1: Manufacturer: Panasonic; Part Number: ERA-2AEB202X; Resistance: 2 kΩ 0.1%
R69 = CMP-2002-08356-1: Part Number: CRCW040220K0FKED; Manufacturer: Vishay Dale; Resistance: 220 Ω
R70 = CMP-2002-07467-1: Part Number: RC0402FR-071K74L; Manufacturer: Yageo; Resistance: 1.74 kΩ
R72 = CMP-1011-00510-4: Chip Resistor, 1 KOhm, +/- 1%, 100 mW, -55 to 155 degC, 0402 (1005 Metric), RoHS, Tape and Reel; PartNumber: ERJ-2RKF1001X; Manufacturer: Basic Passives; Voltage Rating: 50 V; Case\/Package: 0402; Power Rating: 100 mW; DatasheetVersion: 04/2015; Radiation Hardening: No; Pins: 2; Height: 0.35 mm; RoHSCompliant: true; Case Code (Imperial): 0402; ComponentLink2Description: Datasheet; ComponentLink1Description: Manufacturer URL; PackageReference: 0402; Mount: Surface Mount; Package Quantity: 10000; Tolerance: 1%; ComponentLink1URL: http://www.panasonic.com/; PackageDescription: 2-Pin Surface Mount Device, Body 1 x 0.5 mm; Mounting Technology: Surface Mount; Case Code (Metric): 1005; ComponentLink2URL: http://industrial.panasonic.com/cdbs/www-data/pdf/RDA0000/AOA0000C86.pdf; REACH SVHC: Yes; Packaging: Tape and Reel; Max Operating Temperature: 155 degC; Min Operating Temperature: -55 degC; Resistance: 1 KOhm; Width: 0.5 mm; Length: 1 mm
R75 = CMP-2002-08125-1: Manufacturer: Vishay Dale; Part Number: CRCW0402100KJNED
R81 = CMP-1011-00812-2: Manufacturer: Panasonic; Part Number: ERJ2RKF4703X
U1 = CMP-0313-00349-2: 8 Channel 12-Bit SAR Analog-to-Digital Converter with SPI Interface and Temperature Sensor 1MSPS, -40 to +125 degC, CP-20-8, Pb-Free, Tray; Manufacturer: Analog Devices; Generic Part Number: AD7298; Resolution (Bits): 12; Throughput Rate (SPS): 1M; Channels: 9; ComponentLink3URL: http://www.analog.com/static/imported-files/packages/PKG_PDF/LFCSP(CP)/CP-20/CP_20_8.pdf; PackageDescription: 20-Lead Lead Frame Chip Scale Package [LFCSP_WQ] 4 x 4 mm Body, Very Very Thin Quad; ComponentLink2URL: http://www.analog.com/static/imported-files/data_sheets/AD7298.pdf; Packing: Tray; PartNumber: AD7298BCPZ; ComponentLink4URL: http://www.analog.com/en/analog-to-digital-converters/ad-converters/ad7298/products/product.html; RoHS: Y; PackageReference: CP-20-8; PackageVersion: 020509-B; Mounting Technology: Surface Mount; ComponentLink3Description: Package Specification; DatasheetVersion: Rev.B; Code_JEDEC: MO-220-WGGD; ComponentLink2Description: Datasheet; ComponentLink4Description: Product URL; ComponentLink1Description: Manufacturer URL; ComponentLink1URL: http://www.analog.com/en/index.html; Interface: SPI
U3 U9 = CMP-07123-000004-1: IC LOAD SWITCH 0.4-2A OCP 8MLP; Manufacturer: ON Semiconductor; Turn On Delay Time: 2.7ms; Max Junction Temp: +125°C; Turn Off Delay Time: 0.1ms; Nominal Supply Current: 92uA; Number Of Outputs: 1; Max Power Dissipation: 1.25W; Rise Time: 7.5ms; Min Supply Voltage: 2.8V; Standoff Height: 0mm; Max Supply Voltage: 36V; Fall Time: 1.5ms; Device Class L3: Gate Drivers; ComponentLink2URL: https://www.onsemi.com/pub/Collateral/FPF2702-D.pdf; Temperature Range High: +125°C; Manufacturer Part Number: FPF2701MPX; Category: IC; Automotive: No; Device Class L2: Power Management ICs; Octopart: https://octopart.com/fpf2701mpx-on+semiconductor-84327806; Package: 511DD; Ambient Temperature Range Low: -40°C; Temperature: -40°C to +125°C; Height: 0.8mm; Digikey Description: IC LOAD SWITCH 0.4-2A OCP 8MLP; Device Class L1: Integrated Circuits (ICs); ComponentLink2Description: Datasheet; Mouser Description: Power Switch ICs - Power Distribution AccuPower Advanced Load Mngmnt Products; Temperature Range Low: -40°C; Ipc Land Pattern Name: DFN300X300X80-8; RoHS: TRUE; Ambient Temperature Range High: +85°C; Output Current: 0.4-2A; Lead Free: Yes; Footprint Url: https://www.onsemi.com/pub/Collateral/511DD.PDF
U4 U8 = AD590: Supplier 1: Digi-Key
U5 = CMP-0491-01945-1: 4.5 A, 500 kHz Step-Down Switching Regulator, 8-pin SOIC (S8-8), 0 to 125 degC, Pb-Free; Manufacturer: Linear Technology; Frequency Sync Range: 580kHz - 1MHz; Number of Outputs: 1; ComponentLink1Description: Manufacturer URL; PackageReference: S8-8; PartNumber: LT1959CS8#PBF; ComponentLink2Description: Datasheet; ComponentLink3Description: Package Specification; PackageVersion: Rev. G, 03/2012; ComponentLink3URL: http://cds.linear.com/docs/en/packaging/05081610_G_SO8.pdf; ComponentLink1URL: http://www.linear.com/; RoHS: TRUE; PackageDescription: 8-Pin Plastic Small Outline (Narrow .150 Inch), Body 4.9 x 3.9 mm, Pitch 1.27 mm; Mounting Technology: Surface Mount; ComponentLink2URL: http://cds.linear.com/docs/en/datasheet/1959fs.pdf
U7 = CMP-0394-00266-2: Single Output High PSRR LDO, 100 mA, Fixed 3.3 V Output, 2.7 to 5.5 V Input, 5-pin SOT-23 (DBV), -40 to 125 degC, Green (RoHS & no Sb/Br); Manufacturer: Texas Instruments; Rating: Catalog; Vout Adj(Min)(V): 3.3; Vin(Max)(V): 5.5; SubFamily: Single Channel LDO; Accuracy(%): 2; Iout(Max)(A): 0.1; Vin(Min)(V): 2.7; Vdo(Typ)(mV): 50; Iq(Typ)(mA): 0.2; PackageReference: DBV0005A; DatasheetVersion: SLVS325C; PartNumber: TPS79133DBVR; ComponentLink3URL: http://www.ti.com/litv/pdf/mpds018i; Eco-Plan: Green (RoHS & no Sb/Br); ComponentLink3Description: Package Specification; ComponentLink2Description: Datasheet; Vout Adj(Max)(V): 3.3; ComponentLink1URL: http://www.ti.com/; Fixed Output Options(V): 3.3; ComponentLink4URL: Samples URL:http://www.ti.com/product/tps79133#samples; ComponentLink2URL: http://www.ti.com/general/docs/lit/getliterature.tsp?genericPartNumber=TPS79133&fileType=pdf; ComponentLink1Description: Manufacturer URL; Code_JEDEC: MO-178; PackageDescription: 5-Pin Plastic Small Outline, Body 1.60 Ãƒâ€” 2.90 mm, Pitch 0.95 mm; PackageVersion: 4073253-4/K; ComponentLink4Description: URL Link1; Mounting Technology: Surface Mount
U2 U6 = LT6105: ComponentLink1Description: Datasheet; ComponentLink1URL: https://www.analog.com/media/en/technical-documentation/data-sheets/6105fa.pdf